# Altium project Sensor_voltagle.PrjPcb
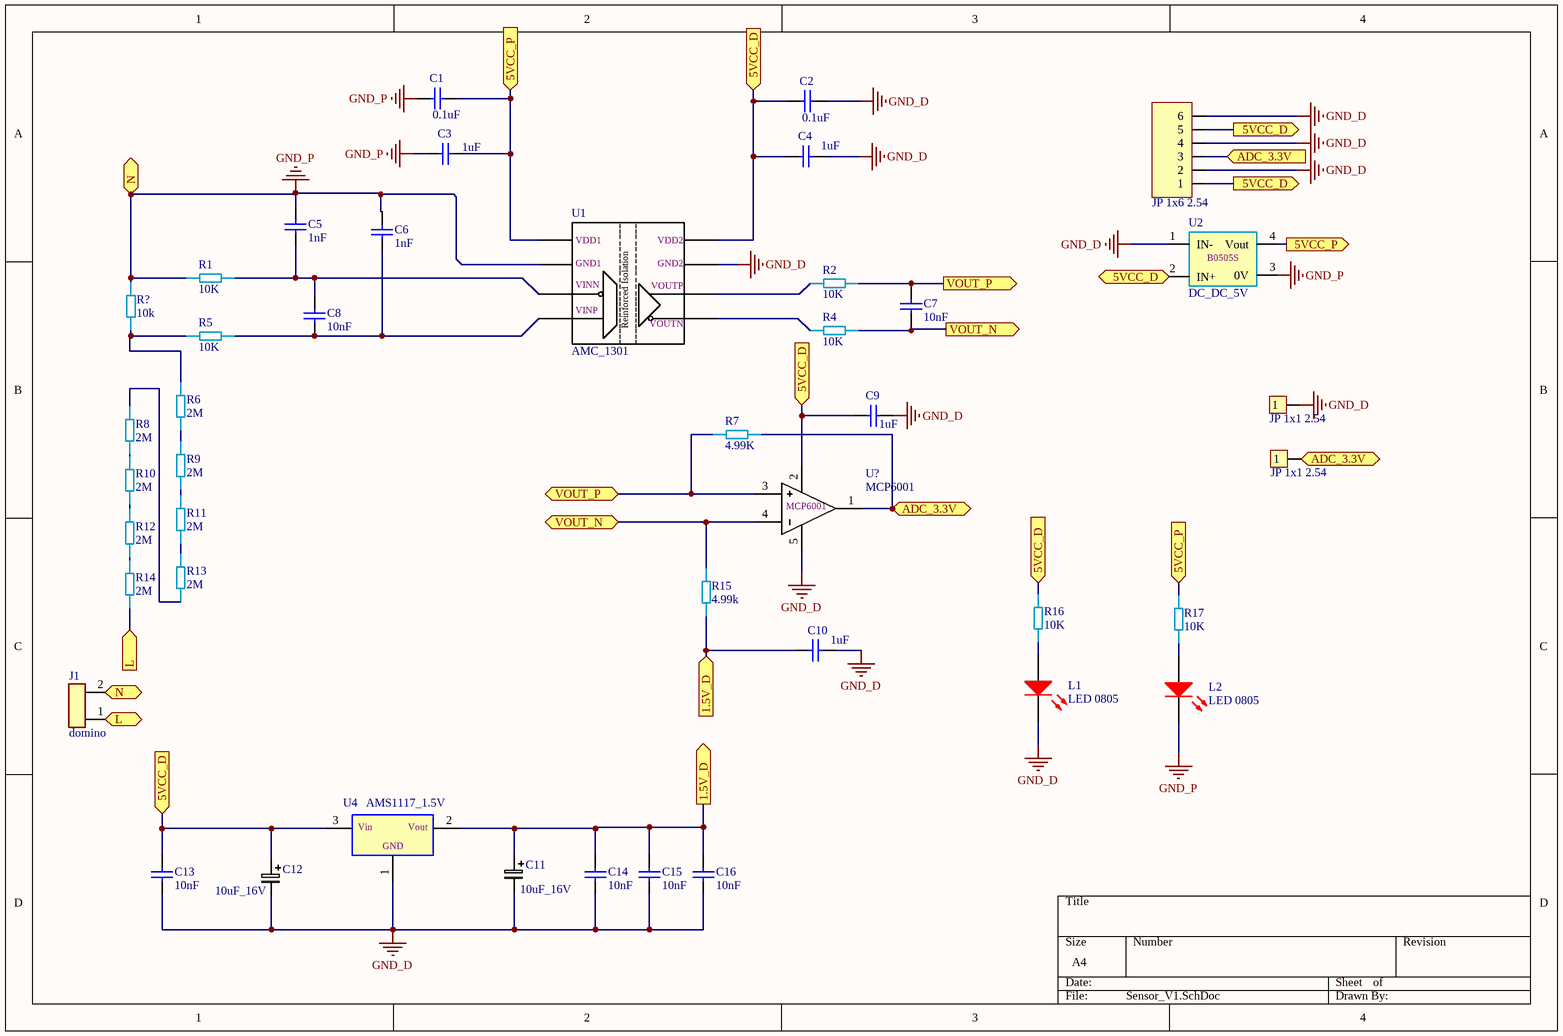
[diagram p0: Sensor_V1.SchDoc]
1 sheet, 43 parts. Net scope: flat (ports and power ports of the same name join across sheets).
Board files: Sensor_Voltage_V1.PcbDoc, Sensor_voltagV1.2.PcbDoc, Sensor_Voltage_V1.1.PcbDoc

## Sheet Sensor_V1.SchDoc
size A4

### Parts
1M  10k  [RES1206]
C1  0.1uF  [Tu 0805_N]
C2  0.1uF  [Tu 0805_N]
C3  1uF  [Tu 0805_N]
C4  1uF  [Tu 0805_N]
C5  1nF  [Tu 0805_N]
C6  1nF  [Tu 0805_N]
C7  10nF  [Tu 0805_N]
C8  10nF  [Tu 0805_N]
C9  1uF  [Tu 0805_N]
C10  1uF  [Tu 0805_N]
C11  10uF_16V  [tu_4x5.4mm]
C12  10uF_16V  [tu_4x5.4mm]
C13  10nF  [Tu 0805_N]
C14  10nF  [Tu 0805_N]
C15  10nF  [Tu 0805_N]
C16  10nF  [Tu 0805_N]
J1  domino  [domino_2pin_5.08mm]
JP1  JP 1x6 2.54  [JP 1X6 DT]
JP2  JP 1x1 2.54  [test_point]
JP3  JP 1x1 2.54  [test_point]
L1  LED 0805  [LED-0805-Red]
L2  LED 0805  [LED-0805-Red]
MC6001  MCP6001  [SOT23_5]
R1  10K  [RES1206]
R2  10K  [RES1206]
R4  10K  [RES1206]
R5  10K  [RES1206]
R6  2M  [RES1206]
R7  4.99K  [RES1206]
R8  2M  [RES1206]
R9  2M  [RES1206]
R10  2M  [RES1206]
R11  2M  [RES1206]
R12  2M  [RES1206]
R13  2M  [RES1206]
R14  2M  [RES1206]
R15  4.99k  [RES1206]
R16  10K  [RES1206]
R17  10K  [RES1206]
U1  AMC_1301  [SOIC_8_SO8W]
U2  DC_DC_5V  [B0505S/D-1W]
U4  AMS1117_1.5V  [TO-252]

### Ports
1.5V_D (in), 1.5V_D (out), 5VCC_D (in), 5VCC_D (out), 5VCC_P (in), 5VCC_P (out), ADC_3.3V (in), ADC_3.3V (out), L (in), L (out), N (in), N (out), VOUT_N, VOUT_N (out), VOUT_P, VOUT_P (out)

### Nets
GND_D: C2.1 C4.2 C9.1 C10.2 C11.2 C12.2 C13.1 C14.1 C15.1 C16.1 JP1.2 JP1.4 JP1.6 JP2.1 L1.2(K) MC6001.5(VEE) U1.5(GND2) U2.1(IN-) U4.1(GND)
GND_P: 1M.1 C1.2 C3.1 C5.2 C6.2 J1.2 L2.2(K) R1.2 U1.4(GND1) U2.3(0V) ; port N
Net1M_2: 1M.2 R5.2 R6.1
NetC1_1: C1.1 C3.2 R17.1 U1.1(VDD1) U2.4(Vout) ; port 5VCC_P
NetC2_2: C2.2 C4.1 C9.2 C12.1 C13.2 JP1.1 JP1.5 MC6001.2(VCC) R16.1 U1.8(VDD2) U2.2(IN+) U4.3(Vin) ; port 5VCC_D
NetC5_1: C5.1 C8.2 R1.1 U1.3(VINN)
NetC6_1: C6.1 C8.1 R5.1 U1.2(VINP)
NetC7_1: C7.1 MC6001.4(INT-) R4.1 R15.1 ; port VOUT_N
NetC7_2: C7.2 MC6001.3(INT+) R2.1 R7.2 ; port VOUT_P
NetC10_1: C10.1 C11.1 C14.2 C15.2 C16.2 R15.2 U4.2(Vout) ; port 1.5V_D
NetJ1_1: J1.1 R14.2 ; port L
NetJP1_3: JP1.3 JP3.1 MC6001.1(OUTPUT) R7.1 ; port ADC_3.3V
NetL1_1: L1.1(A) R16.2
NetL2_1: L2.1(A) R17.2
NetR2_2: R2.2 U1.7(VOUTP)
NetR4_2: R4.2 U1.6(VOUTN)
NetR6_2: R6.2 R9.1
NetR8_1: R8.1 R13.2
NetR8_2: R8.2 R10.1
NetR9_2: R9.2 R11.1
NetR10_2: R10.2 R12.1
NetR11_2: R11.2 R13.1
NetR12_2: R12.2 R14.1

### Notes on the sheet
- (in symbol AMC_1301) Reinforced Isolation
- (in symbol DC_DC_5v) B0505S

### Library data of the parts
1M R1 R2 R4-R17 = 311-0.0GRTR-ND
C1-C10 C13-C16 = cap_0805
C11 C12 = capacitor_electric
JP1 = JP 1x6 2.54 Duc Thang: Cắm; Ten_Linh_Kien: Jump Đơn Đực 2.54MM 1x40P Thẳng 11MM; Don_Vi: Con; Ma_Hang: MH000903; Ghi_Chu: *; Kieu_Chan: *; Chung_Loai: Cắm
JP2 JP3 = JP 1x1 2.54 Duc Thang: Cắm; Ten_Linh_Kien: Jump Đơn Đực 2.54MM 1x40P Thẳng 11MM; Don_Vi: Con; Ma_Hang: MH000903; Ghi_Chu: *; Kieu_Chan: *; Chung_Loai: Cắm
L1 L2 = LED 0805 Do: Dán; Don_Vi: Con; Ma_Hang: MH000897; Ten_Linh_Kien: LED 0805 Màu Đỏ (Red); Ghi_Chu: *; Kieu_Chan: *; Chung_Loai: Dán
U4 = AMS1117CD